# Altium schematic sheet 04_LCD.SchDoc
size A4; Author: Ganghyeok Lim; Revision: B; SheetNumber: 5; SheetTotal: 7
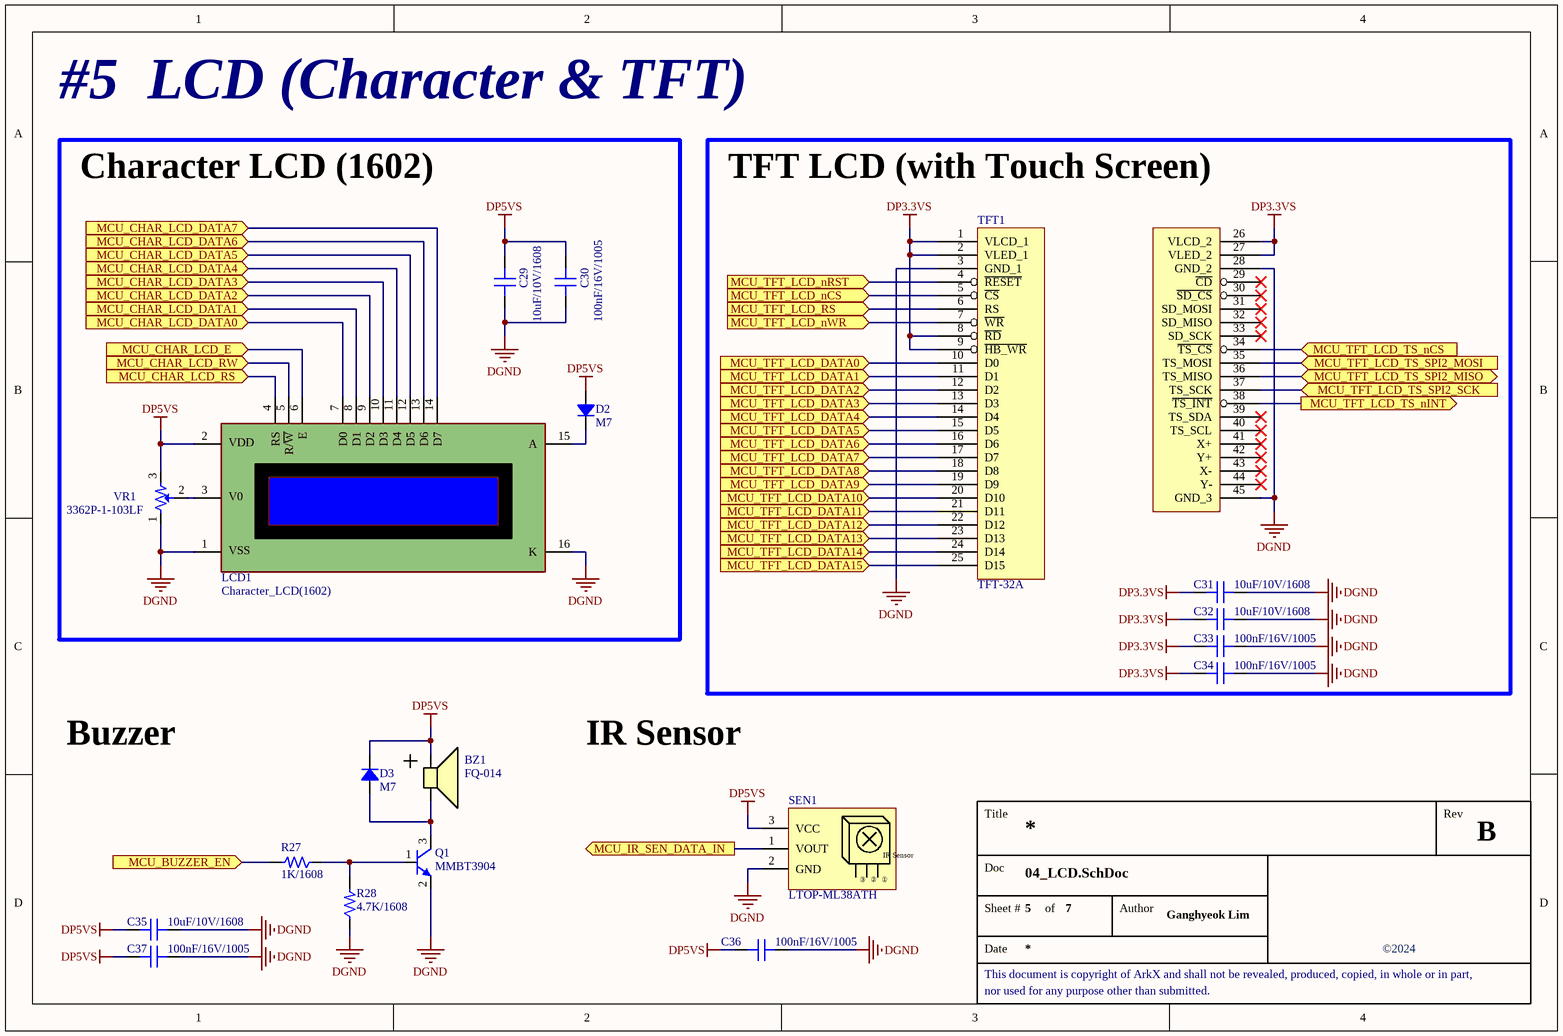
[diagram p0: 04_LCD.SchDoc]

## Parts
BZ1  FQ-014  [BUZ FQ-013]
C29  10uF/10V/1608  [CAP 1608 (0603_INCH)]
C30  100nF/16V/1005  [CAP 1005 (0402_INCH)]
C31  10uF/10V/1608  [CAP 1608 (0603_INCH)]
C32  10uF/10V/1608  [CAP 1608 (0603_INCH)]
C33  100nF/16V/1005  [CAP 1005 (0402_INCH)]
C34  100nF/16V/1005  [CAP 1005 (0402_INCH)]
C35  10uF/10V/1608  [CAP 1608 (0603_INCH)]
C36  100nF/16V/1005  [CAP 1005 (0402_INCH)]
C37  100nF/16V/1005  [CAP 1005 (0402_INCH)]
D2  M7  [DIO DO-214AC (SMA)]
D3  M7  [DIO DO-214AC (SMA)]
LCD1  Character_LCD(1602)  [LCD_CHARACTOR-1602]
Q1  MMBT3904  [SOT 23-3 (DIODES INCORPORATED)]
R27  1K/1608  [RES 1608 (0603_inch)]
R28  4.7K/1608  [RES 1608 (0603_inch)]
SEN1  LTOP-ML38ATH  [SEN_IR-LTOP-ML38ATH]
TFT1  TFT-32A  [LCD_TFT-32A]
VR1  3362P-1-103LF  [VR_3362P-1-103LF]

## Blocks framed on the sheet
Character LCD (1602): C29 C30 D2 LCD1 VR1
TFT LCD (with Touch Screen): C31-C34 TFT1

## Ports
MCU_BUZZER_EN (in), MCU_CHAR_LCD_DATA0 (in), MCU_CHAR_LCD_DATA1 (in), MCU_CHAR_LCD_DATA2 (in), MCU_CHAR_LCD_DATA3 (in), MCU_CHAR_LCD_DATA4 (in), MCU_CHAR_LCD_DATA5 (in), MCU_CHAR_LCD_DATA6 (in), MCU_CHAR_LCD_DATA7 (in), MCU_CHAR_LCD_E (in), MCU_CHAR_LCD_RS (in), MCU_CHAR_LCD_RW (in), MCU_IR_SEN_DATA_IN (out), MCU_TFT_LCD_DATA0 (in), MCU_TFT_LCD_DATA1 (in), MCU_TFT_LCD_DATA2 (in), MCU_TFT_LCD_DATA3 (in), MCU_TFT_LCD_DATA4 (in), MCU_TFT_LCD_DATA5 (in), MCU_TFT_LCD_DATA6 (in), MCU_TFT_LCD_DATA7 (in), MCU_TFT_LCD_DATA8 (in), MCU_TFT_LCD_DATA9 (in), MCU_TFT_LCD_DATA10 (in), MCU_TFT_LCD_DATA11 (in), MCU_TFT_LCD_DATA12 (in), MCU_TFT_LCD_DATA13 (in), MCU_TFT_LCD_DATA14 (in), MCU_TFT_LCD_DATA15 (in), MCU_TFT_LCD_nCS (in), MCU_TFT_LCD_nRST (in), MCU_TFT_LCD_nWR (in), MCU_TFT_LCD_RS (in), MCU_TFT_LCD_TS_nCS (in), MCU_TFT_LCD_TS_nINT (out), MCU_TFT_LCD_TS_SPI2_MISO (bidir), MCU_TFT_LCD_TS_SPI2_MOSI (in), MCU_TFT_LCD_TS_SPI2_SCK (in)

## Nets
DGND: C29.1 C30.1 C31.1 C32.1 C33.1 C34.1 C35.1 C36.1 C37.1 LCD1.1(VSS) LCD1.16(K) Q1.2(E) R28.1 SEN1.2(GND) TFT1.3(GND_1) TFT1.28(GND_2) TFT1.45(GND_3) VR1.1
DP3.3VS: C31.2 C32.2 C33.2 C34.2 TFT1.1(VLCD_1) TFT1.2(VLED_1) TFT1.8(~{RD}) TFT1.9(~{HB_WR}) TFT1.26(VLCD_2) TFT1.27(VLED_2)
DP5VS: BZ1.1 C29.2 C30.2 C35.2 C36.2 C37.2 D2.1 D3.2 LCD1.2(VDD) SEN1.3(VCC) VR1.3
MCU_BUZZER_EN: R27.2 ; port MCU_BUZZER_EN
MCU_CHAR_LCD_DATA0: LCD1.7(D0) ; port MCU_CHAR_LCD_DATA0
MCU_CHAR_LCD_DATA1: LCD1.8(D1) ; port MCU_CHAR_LCD_DATA1
MCU_CHAR_LCD_DATA2: LCD1.9(D2) ; port MCU_CHAR_LCD_DATA2
MCU_CHAR_LCD_DATA3: LCD1.10(D3) ; port MCU_CHAR_LCD_DATA3
MCU_CHAR_LCD_DATA4: LCD1.11(D4) ; port MCU_CHAR_LCD_DATA4
MCU_CHAR_LCD_DATA5: LCD1.12(D5) ; port MCU_CHAR_LCD_DATA5
MCU_CHAR_LCD_DATA6: LCD1.13(D6) ; port MCU_CHAR_LCD_DATA6
MCU_CHAR_LCD_DATA7: LCD1.14(D7) ; port MCU_CHAR_LCD_DATA7
MCU_CHAR_LCD_E: LCD1.6(E) ; port MCU_CHAR_LCD_E
MCU_CHAR_LCD_RS: LCD1.4(RS) ; port MCU_CHAR_LCD_RS
MCU_CHAR_LCD_RW: LCD1.5(R/~{W}) ; port MCU_CHAR_LCD_RW
MCU_IR_SEN_DATA_IN: SEN1.1(VOUT) ; port MCU_IR_SEN_DATA_IN
MCU_TFT_LCD_DATA0: TFT1.10(D0) ; port MCU_TFT_LCD_DATA0
MCU_TFT_LCD_DATA1: TFT1.11(D1) ; port MCU_TFT_LCD_DATA1
MCU_TFT_LCD_DATA2: TFT1.12(D2) ; port MCU_TFT_LCD_DATA2
MCU_TFT_LCD_DATA3: TFT1.13(D3) ; port MCU_TFT_LCD_DATA3
MCU_TFT_LCD_DATA4: TFT1.14(D4) ; port MCU_TFT_LCD_DATA4
MCU_TFT_LCD_DATA5: TFT1.15(D5) ; port MCU_TFT_LCD_DATA5
MCU_TFT_LCD_DATA6: TFT1.16(D6) ; port MCU_TFT_LCD_DATA6
MCU_TFT_LCD_DATA7: TFT1.17(D7) ; port MCU_TFT_LCD_DATA7
MCU_TFT_LCD_DATA8: TFT1.18(D8) ; port MCU_TFT_LCD_DATA8
MCU_TFT_LCD_DATA9: TFT1.19(D9) ; port MCU_TFT_LCD_DATA9
MCU_TFT_LCD_DATA10: TFT1.20(D10) ; port MCU_TFT_LCD_DATA10
MCU_TFT_LCD_DATA11: TFT1.21(D11) ; port MCU_TFT_LCD_DATA11
MCU_TFT_LCD_DATA12: TFT1.22(D12) ; port MCU_TFT_LCD_DATA12
MCU_TFT_LCD_DATA13: TFT1.23(D13) ; port MCU_TFT_LCD_DATA13
MCU_TFT_LCD_DATA14: TFT1.24(D14) ; port MCU_TFT_LCD_DATA14
MCU_TFT_LCD_DATA15: TFT1.25(D15) ; port MCU_TFT_LCD_DATA15
MCU_TFT_LCD_nCS: TFT1.5(~{CS}) ; port MCU_TFT_LCD_nCS
MCU_TFT_LCD_nRST: TFT1.4(~{RESET}) ; port MCU_TFT_LCD_nRST
MCU_TFT_LCD_nWR: TFT1.7(~{WR}) ; port MCU_TFT_LCD_nWR
MCU_TFT_LCD_RS: TFT1.6(RS) ; port MCU_TFT_LCD_RS
MCU_TFT_LCD_TS_nCS: TFT1.34(~{TS_CS}) ; port MCU_TFT_LCD_TS_nCS
MCU_TFT_LCD_TS_nINT: TFT1.38(~{TS_INT}) ; port MCU_TFT_LCD_TS_nINT
MCU_TFT_LCD_TS_SPI2_MISO: TFT1.36(TS_MISO) ; port MCU_TFT_LCD_TS_SPI2_MISO
MCU_TFT_LCD_TS_SPI2_MOSI: TFT1.35(TS_MOSI) ; port MCU_TFT_LCD_TS_SPI2_MOSI
MCU_TFT_LCD_TS_SPI2_SCK: TFT1.37(TS_SCK) ; port MCU_TFT_LCD_TS_SPI2_SCK
NetBZ1_2: BZ1.2 D3.1 Q1.3(C)
NetD2_2: D2.2 LCD1.15(A)
NetLCD1_3: LCD1.3(V0) VR1.2
NetQ1_1: Q1.1(B) R27.1 R28.2

Not connected (* = marked no-connect by the designer): TFT1 29(~{CD})* 30(~{SD_CS})* 31(SD_MOSI)* 32(SD_MISO)* 33(SD_SCK)* 39(TS_SDA)* 40(TS_SCL)* 41(X+)* 42(Y+)* 43(X-)* 44(Y-)*

## Notes on the sheet
- #5  LCD (Character & TFT)
- Buzzer
- IR Sensor
- Title
- Rev
- Doc
- Sheet #
- of
- Author
- This document is copyright of ArkX and shall not be revealed, produced, copied, in whole or in part,
- Date
- ©2024
- nor used for any purpose other than submitted.
- (in symbol SEN_IR_LTOP-ML38ATH) IR Sensor; ③; ②; ①

## Library data of the parts
BZ1 = BZ_FQ-014: Magnetic Active Buzzer / Rated Voltage: 5V / Size: 9x5.5mm
C29 C31 C32 C35 = CAP_10uF/10V/1608: Ceramic CAP_10uF/10V/1608; LCSC Part #: C19702; JLCPCB Part Type: Basic Part
C30 C33 C34 C36 C37 = CAP_100nF/16V/1005: Ceramic CAP_100nF/16V/1005; LCSC Part #: C1525; JLCPCB Part Type: Basic Part
D2 D3 = DIO_M7: 1A 5uA@1kV 1kV 1.1V@1A SMA(DO-214AC)  Diodes - General Purpose ROHS; LCSC Part #: C95872; JLCPCB Part Type: Basic Part
LCD1 = LCD_Character-1602
Q1 = BJT_NPN_MMBT3904: 100nA 40V 200mW 200mA 100@10mA,1V 300MHz 300mV@50mA,5mA NPN +150℃@(Tj) SOT-23(SOT-23-3)  Bipolar Transistors - BJT ROHS; LCSC Part #: C20526; JLCPCB Part Type: Basic Part
R27 = RES_1K/1608/0.1W: Value: 1K; Power Rating: 0.1W; Precision: 1%; Size: 1608; LCSC Part #: C21190; JLCPCB Part Type: Basic Part
R28 = RES_4.7K/1608/0.1W: Value: 4.7K; Power Rating: 0.1W; Precision: 1%; Size: 1608; LCSC Part #: C23162; JLCPCB Part Type: Basic Part
SEN1 = SEN_IR_LTOP-ML38ATH
TFT1 = LCD_TFT-32A
VR1 = VR_3362P-1-103LF: ±10% ±100ppm/℃ 10kΩ Plugin  Variable Resistors/Potentiometers ROHS; LCSC Part #: C58159; JLCPCB Part Type: Extended Part